# Altium project PCB_Project.PrjPcb
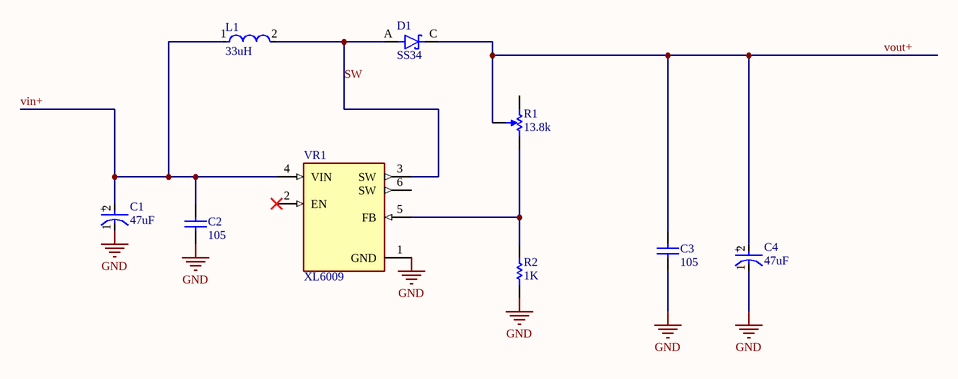
[diagram p0: Sheet1.SchDoc]
1 sheet, 9 parts. Net scope: global (net labels, ports and power ports of the same name join across sheets).
Board file: PCB1.PcbDoc

## Sheet Sheet1.SchDoc
size A; SheetNumber: 1; SheetTotal: 1

### Parts
C1  47uF  [FP-FPD-MFG]
C2  105  [CAPC1608X90X40ML10T20]
C3  105  [CAPC1608X90X40ML10T20]
C4  47uF  [FP-FPD-MFG]
D1  SS34  [DIOM7959X265N]
L1  33uH  [FP-LQH43CN_03-MFG]
R1  13.8k  [BOUR-3290W]
R2  1K  [RESC2013X60X35ML10T20]
VR1  XL6009  [DPAK170P1435X465-6N]

### Nets
GND: C1.1(C) C2.1 C3.1 C4.1(C) R2.1 VR1.1(GND)
SW: D1.A L1.2 VR1.3(SW)
vin+: C1.2(A) C2.2 L1.1 VR1.4(VIN)
vout+: C3.2 C4.2(A) D1.C(K) R1.2
NetR1_3: R1.3 R2.2 VR1.5(FB)

Not connected (* = marked no-connect by the designer): R1 1; VR1 2(EN)* 6(SW)

### Notes on the sheet
- (in symbol CMP-2000-06216-2) +

### Library data of the parts
C1 C4 = CMP-2000-06216-2: CAP ALUM 47UF 20% 35V SMD; Life (Hours): 2000Hour; Leakage Current: 3uA; Dissipation Factor: 0.12%; Material: Aluminium; Ripple Current (AC): 300mA; ESR (Equivalent Series Resistance): 260mR; Construction: Cylindrical; Contact Plating: Tin; Termination: SMD/SMT; RoHS Compliant: Yes; Voltage Rating (DC): 35V; Package Quantity: 1; Tolerance: 20%; Mount: Surface Mount; Diameter: 6.3mm; Lead Free: Lead Free; Number of Pins: 2; Radiation Hardening: No; Series: FP; REACH SVHC: No SVHC; Length: 5.8mm; Height - Seated (Max): 0.228inch; Capacitance: 47uF; Packaging: Tape and Reel; Voltage Rating: 35V; Min Operating Temperature: -55°C; Voltage: 35V; Case/Package: Radial; Max Operating Temperature: 105°C; Ripple Current: 300mA; Height: 5.8mm; Lead Pitch: 1.8mm
C2 C3 = CMP-2100-03594-1: Chip Capacitor, 100 pF, +/- 5%, 50 V, -55 to 125 degC, 0603 (1608 Metric), RoHS, Tape and Reel; Manufacturer: Yageo; Capacitance: 100pF; Voltage Rating (DC): 50V; Dielectric: C0G; Temperature Coefficient: 30ppm/degC; Insulation Resistance: 100GR; Datasheet Version: Rev. 14, 07/2016; Manufacturer URL: http://www.yageo.com/; Packaging: TapeandReel; Mount: SurfaceMount; RoHSCompliant: True; Package Reference: 0603; Tolerance: 5%; Max Operating Temperature: 125degC; Case Code (Imperial): 0603; Number of Pins: 2; Width: 0.8mm; Case Code (Metric): 1608; Voltage: 50V; REACH SVHC: Unknown; Package Description: 2-Pin Surface Mount Device, Body 1.6 x 0.8 mm; Composition: Ceramic; Lead Free: LeadFree; Min Operating Temperature: -55degC; Radiation Hardening: No; Depth: 0.8mm; Thickness: 0.035inch; Datasheet URL: http://www.yageo.com/documents/recent/UPY-GP_NP0_16V-to-50V_14.pdf; Termination: SMD/SMT; Package Quantity: 1; Length: 1.6mm; Voltage Rating: 50V; Height: 0.8mm; Case/Package: 0603
D1 = SS34: Diode Schottky 40 V 3A Surface Mount SMC (DO-214AB); MF: ON Semiconductor; Package: SMC-2 ON Semiconductor; MP: SS34; Value: *; Availability: In Stock; SnapEDA_Link: https://www.snapeda.com/parts/SS34/Onsemi/view-part/?ref=snap; Price: None; Check_prices: https://www.snapeda.com/parts/SS34/Onsemi/view-part/?ref=eda
L1 = CMP-06042-007035-1: Wire Wound Ferrite Inductor for General Circuits 10μH ±10% 0.56Ω 400mA 1812; Inductance: 10uH; Series Resistance: 560mR; Shielding: Unshielded; Q Factor: 35; Self Resonant Frequency: 23MHz; Current: 360mA; Test Frequency: 1MHz; Height: 2.6mm; Min Operating Temperature: -40°C; Termination: SMD/SMT; Radiation Hardening: No; Packaging: Tape and Reel; Inductance Tolerance: 10%; DC Current: 400mA; Tolerance: 10%; DC Resistance (DCR): 560mR; Military Standard: Not; Case/Package: 1812; Max DC Current: 400mA; Case Code (Metric): 4532; Width: 3.2mm; Depth: 3.4mm; Package Quantity: 500; Current Rating: 400mA; Lead Free: Lead Free; Weight: 0.004586oz; Max Operating Temperature: 85°C; Core Material: Ferrite; Frequency: 23MHz; Length: 4.5mm; REACH SVHC: No SVHC; Mount: Surface Mount; Case Code (Imperial): 1812
R1 = CMP-2000-05581-1: Trimming Potentiometer, 20 KOhm, 1 W, -65 to 150 degC, 3-Pin THD, RoHS, Tube; Manufacturer: Bourns; No. of Turns: 25; Potentiometer Mounting: ThroughHole; Temperature Coefficient: ±50ppm/°C; Power Rating: 1W; SVHC: NoSVHC(15-Jun-2015); Resistance Tolerance: ±5%; Product Range: AEC-Q2003290WSeries; Track Resistance: 20kohm; Datasheet URL: http://www.bourns.com/docs/Product-Datasheets/3290.pdf; Datasheet Version: 04/2014; Mounting Technology: ThroughHole; Package Description: 3-Pin Through Hole Device, Body 9.53 x 3.81 mm, Pitch 2.54 mm; Manufacturer URL: http://www.bourns.com/; Package Reference: 3290W
R2 = CMP-2100-03671-1: Chip Resistor, 1 KOhm, +/- 1%, 125 mW, -55 to 155 degC, 0805 (2012 Metric), RoHS, Tape and Reel; Manufacturer: Yageo; Temperature Coefficient: 100ppm/degreesC; Voltage Rating (DC): 150V; Max Power Dissipation: 125mW; Resistance: 1KOhm; Number of Pins: 2; Number of Terminations: 2; Datasheet URL: http://www.yageo.com/NewPortal/yageodocoutput?fileName=/pdf/R-Chip/PYu-RC_Group_51_RoHS_L_5.pdf; Length: 0.079inch; Package Description: 2-Pin Surface Mounted Device, Body 2 x 1.25 mm; Depth: 1.25mm; Height: 0.024inch; Military Standard: Not; Case/Package: 0805; Package Reference: 0805; RoHSCompliant: true; Lead Free: LeadFree; Packaging: TapeandReel; Package Quantity: 1; Datasheet Version: Rev. 5, 10/2016; Tolerance: 1%; Min Operating Temperature: -55degC; Voltage Rating: 150V; Composition: ThickFilm; Case Code (Imperial): 0805; Power Rating: 125mW; Width: 0.049inch; Case Code (Metric): 2012; Manufacturer URL: http://www.yageo.com/; Max Operating Temperature: 155degC; REACH SVHC: Unknown; Termination: SMD/SMT
VR1 = XL6009: The XL6009 regulator is a wide input range, current mode, DC/DC converter which is capable of generating either positive or negative output voltages.; MF: XLSEMI; Value: *; SnapEDA_Link: https://www.snapeda.com/parts/XL6009/XLSEMI/view-part/?ref=snap; MP: XL6009; Check_prices: https://www.snapeda.com/parts/XL6009/XLSEMI/view-part/?ref=eda; Availability: Not in stock; Price: None; Package: TO-263-5L XLSEMI